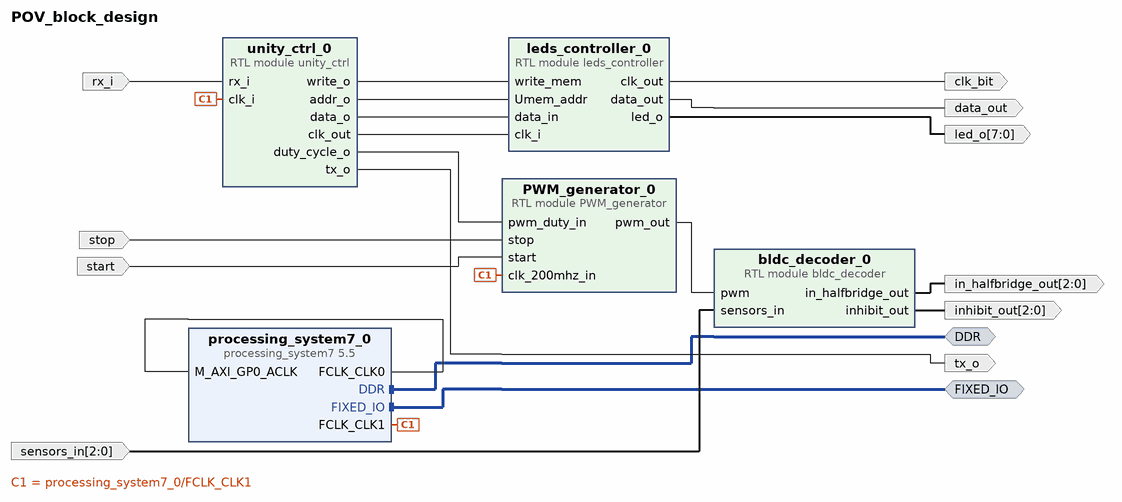
[diagram p0: block diagram of the top level]
# Vivado block design POV_block_design, xc7z010clg225-1, Vivado 2017.2
create_bd_design POV_block_design

create_bd_intf_port -mode Master -vlnv xilinx.com:interface:ddrx_rtl:1.0 DDR
create_bd_intf_port -mode Master -vlnv xilinx.com:display_processing_system7:fixedio_rtl:1.0 FIXED_IO
create_bd_port -dir I -from 2 -to 0 sensors_in
create_bd_port -dir O -from 2 -to 0 in_halfbridge_out
create_bd_port -dir O -from 2 -to 0 inhibit_out
create_bd_port -dir I rx_i
create_bd_port -dir O tx_o
create_bd_port -dir O data_out
create_bd_port -dir O clk_bit
create_bd_port -dir O -from 7 -to 0 led_o
create_bd_port -dir I stop
create_bd_port -dir I start

create_bd_cell -type ip -vlnv xilinx.com:ip:processing_system7:5.5 processing_system7_0
set_property -dict [list \
  CONFIG.PCW_FCLK_CLK1_BUF TRUE \
  CONFIG.PCW_UIPARAM_DDR_FREQ_MHZ 533.333333 \
  CONFIG.PCW_APU_PERIPHERAL_FREQMHZ 666.666666 \
  CONFIG.PCW_SDIO_PERIPHERAL_FREQMHZ 100 \
  CONFIG.PCW_UART_PERIPHERAL_FREQMHZ 100 \
  CONFIG.PCW_I2C_PERIPHERAL_FREQMHZ 111.111115 \
  CONFIG.PCW_FPGA0_PERIPHERAL_FREQMHZ 50 \
  CONFIG.PCW_FPGA1_PERIPHERAL_FREQMHZ 200 \
  CONFIG.PCW_FPGA2_PERIPHERAL_FREQMHZ 1 \
  CONFIG.PCW_M_AXI_GP0_FREQMHZ 50 \
  CONFIG.PCW_USE_FABRIC_INTERRUPT 1 \
  CONFIG.PCW_NUM_F2P_INTR_INPUTS 1 \
  CONFIG.PCW_DQ_WIDTH 16 \
  CONFIG.PCW_DQS_WIDTH 2 \
  CONFIG.PCW_DM_WIDTH 2 \
  CONFIG.PCW_MIO_PRIMITIVE 32 \
  CONFIG.PCW_EN_CLK1_PORT 1 \
  CONFIG.PCW_EN_CLK2_PORT 1 \
  CONFIG.PCW_IRQ_F2P_INTR 1 \
  CONFIG.PCW_PERIPHERAL_BOARD_PRESET part0 \
  CONFIG.PCW_PRESET_BANK1_VOLTAGE {LVCMOS 3.3V} \
  CONFIG.PCW_UIPARAM_DDR_MEMORY_TYPE {DDR 3 (Low Voltage)} \
  CONFIG.PCW_UIPARAM_DDR_BUS_WIDTH {16 Bit} \
  CONFIG.PCW_UIPARAM_DDR_PARTNO {MT41J256M16 RE-125} \
  CONFIG.PCW_QSPI_PERIPHERAL_ENABLE 1 \
  CONFIG.PCW_QSPI_QSPI_IO {MIO 1 .. 6} \
  CONFIG.PCW_QSPI_GRP_SINGLE_SS_ENABLE 1 \
  CONFIG.PCW_QSPI_GRP_SINGLE_SS_IO {MIO 1 .. 6} \
  CONFIG.PCW_ENET0_PERIPHERAL_ENABLE 0 \
  CONFIG.PCW_SD0_PERIPHERAL_ENABLE 0 \
  CONFIG.PCW_SD1_PERIPHERAL_ENABLE 1 \
  CONFIG.PCW_SD1_SD1_IO {MIO 10 .. 15} \
  CONFIG.PCW_SD1_GRP_CD_ENABLE 1 \
  CONFIG.PCW_SD1_GRP_CD_IO {MIO 0} \
  CONFIG.PCW_UART1_PERIPHERAL_ENABLE 1 \
  CONFIG.PCW_UART1_UART1_IO {MIO 8 .. 9} \
  CONFIG.PCW_TTC0_PERIPHERAL_ENABLE 1 \
  CONFIG.PCW_TTC0_TTC0_IO EMIO \
  CONFIG.PCW_USB0_PERIPHERAL_ENABLE 1 \
  CONFIG.PCW_USB0_USB0_IO {MIO 28 .. 39} \
  CONFIG.PCW_USB_RESET_ENABLE 1 \
  CONFIG.PCW_USB_RESET_SELECT {Share reset pin} \
  CONFIG.PCW_USB0_RESET_ENABLE 1 \
  CONFIG.PCW_USB0_RESET_IO {MIO 7} \
  CONFIG.PCW_I2C1_PERIPHERAL_ENABLE 1 \
  CONFIG.PCW_I2C1_I2C1_IO {MIO 48 .. 49} \
  CONFIG.PCW_I2C1_GRP_INT_ENABLE 1 \
  CONFIG.PCW_I2C1_GRP_INT_IO EMIO \
  CONFIG.PCW_I2C_RESET_ENABLE 1 \
  CONFIG.PCW_I2C_RESET_SELECT {Share reset pin} \
  CONFIG.PCW_GPIO_MIO_GPIO_ENABLE 1 \
  CONFIG.PCW_GPIO_MIO_GPIO_IO MIO \
  CONFIG.PCW_APU_CLK_RATIO_ENABLE 0.251400462962963 \
  CONFIG.PCW_ENET0_PERIPHERAL_CLKSRC External \
  CONFIG.PCW_UIPARAM_GENERATE_SUMMARY NONE \
  CONFIG.PCW_FPGA_FCLK1_ENABLE 1 \
] [get_bd_cells processing_system7_0]
# 425 more settings of processing_system7_0 are not shown: defaults, MIO pin electricals, DDR timing, and values the tool derives
create_bd_cell -type module -reference bldc_decoder bldc_decoder_0
create_bd_cell -type module -reference unity_ctrl unity_ctrl_0
create_bd_cell -type module -reference PWM_generator PWM_generator_0
create_bd_cell -type module -reference leds_controller leds_controller_0

# ---- connections ----

connect_bd_intf_net [get_bd_intf_ports DDR] [get_bd_intf_pins processing_system7_0/DDR]
connect_bd_intf_net [get_bd_intf_ports FIXED_IO] [get_bd_intf_pins processing_system7_0/FIXED_IO]
connect_bd_net [get_bd_pins processing_system7_0/FCLK_CLK0] [get_bd_pins processing_system7_0/M_AXI_GP0_ACLK]
connect_bd_net [get_bd_ports sensors_in] [get_bd_pins bldc_decoder_0/sensors_in]
connect_bd_net [get_bd_pins bldc_decoder_0/in_halfbridge_out] [get_bd_ports in_halfbridge_out]
connect_bd_net [get_bd_pins bldc_decoder_0/inhibit_out] [get_bd_ports inhibit_out]
connect_bd_net [get_bd_pins PWM_generator_0/pwm_out] [get_bd_pins bldc_decoder_0/pwm]
connect_bd_net [get_bd_ports rx_i] [get_bd_pins unity_ctrl_0/rx_i]
connect_bd_net [get_bd_pins unity_ctrl_0/tx_o] [get_bd_ports tx_o]
connect_bd_net [get_bd_pins unity_ctrl_0/duty_cycle_o] [get_bd_pins PWM_generator_0/pwm_duty_in]
connect_bd_net -net unity_ctrl_0_write_mem [get_bd_pins unity_ctrl_0/write_o] [get_bd_pins leds_controller_0/write_mem]
connect_bd_net -net unity_ctrl_0_Umem_addr_i [get_bd_pins unity_ctrl_0/addr_o] [get_bd_pins leds_controller_0/Umem_addr]
connect_bd_net -net unity_ctrl_0_mem_data_out [get_bd_pins unity_ctrl_0/data_o] [get_bd_pins leds_controller_0/data_in]
connect_bd_net [get_bd_pins leds_controller_0/data_out] [get_bd_ports data_out]
connect_bd_net [get_bd_pins leds_controller_0/clk_out] [get_bd_ports clk_bit]
connect_bd_net [get_bd_pins processing_system7_0/FCLK_CLK1] [get_bd_pins unity_ctrl_0/clk_i] [get_bd_pins PWM_generator_0/clk_200mhz_in]
connect_bd_net [get_bd_pins unity_ctrl_0/clk_out] [get_bd_pins leds_controller_0/clk_i]
connect_bd_net [get_bd_pins leds_controller_0/led_o] [get_bd_ports led_o]
connect_bd_net [get_bd_ports stop] [get_bd_pins PWM_generator_0/stop]
connect_bd_net [get_bd_ports start] [get_bd_pins PWM_generator_0/start]

validate_bd_design
save_bd_design
